# EAGLE design Task12PDS_PCBver9 (EAGLE 8.0.2)
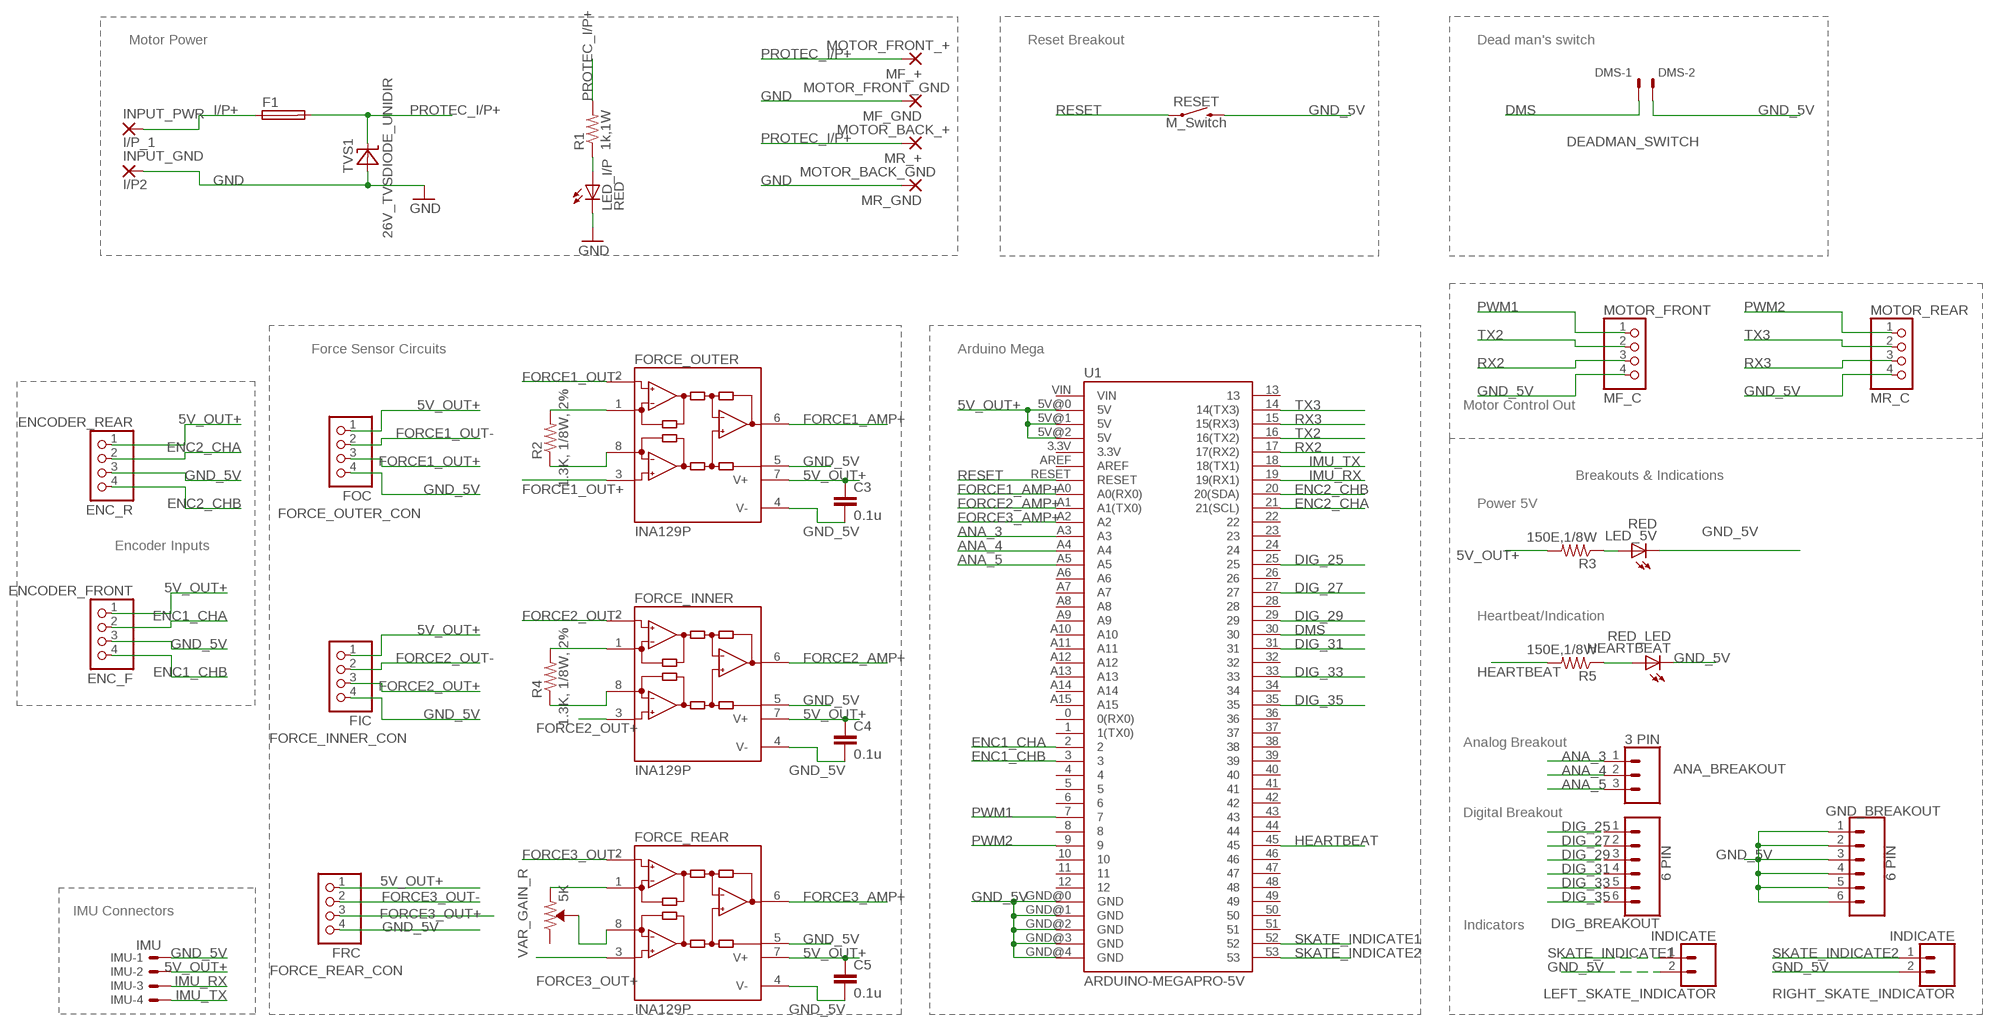
[diagram p0: schematic, sheet 1]

## Parts
ANA_BREAKOUT  3 PIN  CONN_03  [1X03]
C3  0.1u  C-EUC1206  [C1206]
C4  0.1u  C-EUC1206  [C1206]
C5  0.1u  C-EUC1206  [C1206]
DIG_BREAKOUT  6 PIN  CONN_06SILK_FEMALE_PTH  [1X06]
DMS  DEADMAN_SWITCH  22-23-2021  [22-23-2021]
ENCODER_FRONT  ENC_F  PINHD-1X4/90  [1X04/90]
ENCODER_REAR  ENC_R  PINHD-1X4/90  [1X04/90]
F1  FASTBLOW_FUSE_10A  TE5  [TE5]
FORCE_INNER  INA129P  [DIL08]
FORCE_INNER_CON  FIC  PINHD-1X4/90  [1X04/90]
FORCE_OUTER  INA129P  [DIL08]
FORCE_OUTER_CON  FOC  PINHD-1X4/90  [1X04/90]
FORCE_REAR  INA129P  [DIL08]
FORCE_REAR_CON  FRC  PINHD-1X4/90  [1X04/90]
GND_BREAKOUT  6 PIN  CONN_06SILK_FEMALE_PTH  [1X06]
HEARTBEAT  RED_LED  LEDSMT1206  [1206]
IMU  IMU  22-23-2041  [22-23-2041]
INPUT_GND  I/P2  WIREPAD3,81/1,1  [3,81/1,1]
INPUT_PWR  I/P_1  WIREPAD3,81/1,1  [3,81/1,1]
LED_5V  RED  LEDSMT1206  [1206]
LED_I/P  RED  LEDSMT1206  [1206]
LEFT_SKATE_INDICATOR  INDICATE  CONN_02  [1X02]
MF_+  MOTOR_FRONT_+  WIREPAD3,81/1,1  [3,81/1,1]
MF_GND  MOTOR_FRONT_GND  WIREPAD3,81/1,1  [3,81/1,1]
MOTOR_FRONT  MF_C  PINHD-1X4/90  [1X04/90]
MOTOR_REAR  MR_C  PINHD-1X4/90  [1X04/90]
MR_+  MOTOR_BACK_+  WIREPAD3,81/1,1  [3,81/1,1]
MR_GND  MOTOR_BACK_GND  WIREPAD3,81/1,1  [3,81/1,1]
R1  1k,1W  R-US_M1206  [M1206]
R2  1.3K, 1/8W, 2%  R-US_M1206  [M1206]
R3  150E,1/8W  R-US_M1206  [M1206]
R4  1.3K, 1/8W, 2%  R-US_M1206  [M1206]
R5  150E,1/8W  R-US_M1206  [M1206]
RESET  M_Switch  MOMENTARY-SWITCH-SPST-PTH-6.0MM  [TACTILE_SWITCH_PTH_6.0MM]
RIGHT_SKATE_INDICATOR  INDICATE  CONN_02  [1X02]
TVS1  26V_TVSDIODE_UNIDIR  [DO214AC]
U1  ARDUINO-MEGAPRO-5V  [ARDUINO_MEGA-PRO-5V]
VAR_GAIN_R  5K  TRIMPOT-PTH-10MM-KNOB-1/2W-10%  [TRIMPOT-PTH-3386U]

## Nets
5V_OUT+: C3.1 C4.1 C5.1 ENCODER_FRONT.1 ENCODER_REAR.1 FORCE_INNER.7(V+) FORCE_INNER_CON.1 FORCE_OUTER.7(V+) FORCE_OUTER_CON.1 FORCE_REAR.7(V+) FORCE_REAR_CON.1 IMU.2 R3.2 U1.5V@0(5V) U1.5V@1(5V) U1.5V@2(5V)
ANA_3: ANA_BREAKOUT.1 U1.A3
ANA_4: ANA_BREAKOUT.2 U1.A4
ANA_5: ANA_BREAKOUT.3 U1.A5
DIG_25: DIG_BREAKOUT.1 U1.25
DIG_27: DIG_BREAKOUT.2 U1.27
DIG_29: DIG_BREAKOUT.3 U1.29
DIG_31: DIG_BREAKOUT.4 U1.31
DIG_33: DIG_BREAKOUT.5 U1.33
DIG_35: DIG_BREAKOUT.6 U1.35
DMS: DMS.1 U1.30
ENC1_CHA: ENCODER_FRONT.2 U1.2
ENC1_CHB: ENCODER_FRONT.4 U1.3
ENC2_CHA: ENCODER_REAR.2 U1.21(21(SCL))
ENC2_CHB: ENCODER_REAR.4 U1.20(20(SDA))
FORCE1_AMP+: FORCE_OUTER.6(OUT) U1.A0(A0(RX0))
FORCE1_OUT+: FORCE_OUTER.3(+IN) FORCE_OUTER_CON.3
FORCE1_OUT-: FORCE_OUTER.2(-IN) FORCE_OUTER_CON.2
FORCE2_AMP+: FORCE_INNER.6(OUT) U1.A1(A1(TX0))
FORCE2_OUT+: FORCE_INNER.3(+IN) FORCE_INNER_CON.3
FORCE2_OUT-: FORCE_INNER.2(-IN) FORCE_INNER_CON.2
FORCE3_AMP+: FORCE_REAR.6(OUT) U1.A2
FORCE3_OUT+: FORCE_REAR.3(+IN) FORCE_REAR_CON.3
FORCE3_OUT-: FORCE_REAR.2(-IN) FORCE_REAR_CON.2
GND: INPUT_GND.1(P) LED_I/P.C MF_GND.1(P) MR_GND.1(P) TVS1.A
GND_5V: C3.2 C4.2 C5.2 DMS.2 ENCODER_FRONT.3 ENCODER_REAR.3 FORCE_INNER.4(V-) FORCE_INNER.5(REF) FORCE_INNER_CON.4 FORCE_OUTER.4(V-) FORCE_OUTER.5(REF) FORCE_OUTER_CON.4 FORCE_REAR.4(V-) FORCE_REAR.5(REF) FORCE_REAR_CON.4 GND_BREAKOUT.1 GND_BREAKOUT.2 GND_BREAKOUT.3 GND_BREAKOUT.4 GND_BREAKOUT.5 GND_BREAKOUT.6 HEARTBEAT.C IMU.1 LED_5V.C LEFT_SKATE_INDICATOR.2 MOTOR_FRONT.4 MOTOR_REAR.4 RESET.3 RIGHT_SKATE_INDICATOR.2 U1.GND@0(GND) U1.GND@1(GND) U1.GND@2(GND) U1.GND@3(GND) U1.GND@4(GND)
HEARTBEAT: R5.2 U1.45
I/P+: F1.1 INPUT_PWR.1(P)
IMU_RX: IMU.3 U1.19(19(RX1))
IMU_TX: IMU.4 U1.18(18(TX1))
N$1: HEARTBEAT.A R5.1
N$2: FORCE_OUTER.1(RG) R2.2
N$3: LED_I/P.A R1.1
N$4: FORCE_OUTER.8(RG) R2.1
N$5: LED_5V.A R3.1
N$6: FORCE_INNER.1(RG) R4.2
N$7: FORCE_INNER.8(RG) R4.1
N$8: FORCE_REAR.1(RG) VAR_GAIN_R.1(CCW)
N$9: FORCE_REAR.8(RG) VAR_GAIN_R.2(WIPER)
PROTEC_I/P+: F1.2 MF_+.1(P) MR_+.1(P) R1.2 TVS1.C
PWM1: MOTOR_FRONT.1 U1.7
PWM2: MOTOR_REAR.1 U1.9
RESET: RESET.1 U1.RESET
RX2: MOTOR_FRONT.3 U1.17(17(RX2))
RX3: MOTOR_REAR.3 U1.15(15(RX3))
SKATE_INDICATE1: LEFT_SKATE_INDICATOR.1 U1.52
SKATE_INDICATE2: RIGHT_SKATE_INDICATOR.1 U1.53
TX2: MOTOR_FRONT.2 U1.16(16(TX2))
TX3: MOTOR_REAR.2 U1.14(14(TX3))
Unconnected: U1.0(0(RX0)) U1.1(1(TX0)) U1.3.3V U1.4 U1.5 U1.6 U1.8 U1.10 U1.11 U1.12 U1.13 U1.22 U1.23 U1.24 U1.26 U1.28 U1.32 U1.34 U1.36 U1.37 U1.38 U1.39 U1.40 U1.41 U1.42 U1.43 U1.44 U1.46 U1.47 U1.48 U1.49 U1.50 U1.51 U1.A6 U1.A7 U1.A8 U1.A9 U1.A10 U1.A11 U1.A12 U1.A13 U1.A14 U1.A15 U1.AREF U1.VIN VAR_GAIN_R.3(CW)

## Notes on the sheet
- Motor Power | Reset Breakout | Dead man's switch
- Force Sensor Circuits | Arduino Mega
- Motor Control Out
- Breakouts & Indications
- Power 5V
- Encoder Inputs
- Heartbeat/Indication
- Analog Breakout
- Digital Breakout
- IMU Connectors
- Indicators

## Library data of the parts
ANA_BREAKOUT = SparkFun-Coils:CONN_03: Multi connection point. Often used as Generic Header-pin footprint for 0.1 inch spaced/style header connections On any of the 0.1 inch spaced packages, you can populate with these: Break Away Headers - Straight <https://www.sparkfun.com/products/116> (PRT-00116) Break Away Male Headers - Right Angle <https://www.sparkfun.com/products/553> (PRT-00553) Female Headers <https://www.sparkfun.com/products/115> (PRT-00115) Break Away Headers - Machine Pin <https://www.sparkfun.com/products/117> (PRT-00117) Break Away Female Headers - Swiss Machine Pin <https://www.sparkfun.com/products/743> (PRT-00743) Stackable Header - 3 Pin (Female, 0.1") <https://www.sparkfun.com/products/13875> (PRT-13875) For SCREWTERMINALS and SPRING TERMINALS visit here: Screw Terimnals on SparkFun.com <https://www.sparkfun.com/search/results?term=Screw+Terminals> (5mm/3.5mm/2.54mm spacing) This device is also useful as a general connection point to wire up your design to another part of your project. Our various solder wires solder well into these plated through hole pads. Hook-Up Wire - Assortment (Stranded, 22 AWG) <https://www.sparkfun.com/products/11375> (PRT-11375) Hook-Up Wire - Assortment (Solid Core, 22 AWG) <https://www.sparkfun.com/products/11367> (PRT-11367) View the entire wire category on our website here <https://www.sparkfun.com/categories/141> Special notes: Molex polarized connector foot print use with SKU : PRT-08232 with associated crimp pins and housings.
C3-C5 = rcl:C-EU: CAPACITOR, European symbol
DIG_BREAKOUT GND_BREAKOUT = SparkFun-Coils:CONN_06: Multi connection point. Often used as Generic Header-pin footprint for 0.1 inch spaced/style header connections On any of the 0.1 inch spaced packages, you can populate with these: Break Away Headers - Straight <https://www.sparkfun.com/products/116> (PRT-00116) Break Away Male Headers - Right Angle <https://www.sparkfun.com/products/553> (PRT-00553) Female Headers <https://www.sparkfun.com/products/115> (PRT-00115) Break Away Headers - Machine Pin <https://www.sparkfun.com/products/117> (PRT-00117) Break Away Female Headers - Swiss Machine Pin <https://www.sparkfun.com/products/743> (PRT-00743) Arduino Stackable Header - 6 Pin <https://www.sparkfun.com/products/9280> (PRT-09280) For SCREWTERMINALS and SPRING TERMINALS visit here: Screw Terimnals on SparkFun.com <https://www.sparkfun.com/search/results?term=Screw+Terminals> (5mm/3.5mm/2.54mm spacing) This device is also useful as a general connection point to wire up your design to another part of your project. Our various solder wires solder well into these plated through hole pads. Hook-Up Wire - Assortment (Stranded, 22 AWG) <https://www.sparkfun.com/products/11375> (PRT-11375) Hook-Up Wire - Assortment (Solid Core, 22 AWG) <https://www.sparkfun.com/products/11367> (PRT-11367) View the entire wire category on our website here <https://www.sparkfun.com/categories/141>; PROD_ID: CONN-08437
DMS = con-molex:22-23-2021: .100" (2.54mm) Center Header - 2 Pin; MF: MOLEX; MPN: 22-23-2021; OC_FARNELL: 1462926; OC_NEWARK: 25C3832
ENCODER_FRONT ENCODER_REAR FORCE_INNER_CON FORCE_OUTER_CON FORCE_REAR_CON MOTOR_FRONT MOTOR_REAR = pinhead:PINHD-1X4: PIN HEADER
F1 = fuse:TE5: FUSE Wickmann; OC_FARNELL: unknown; OC_NEWARK: unknown
FORCE_INNER FORCE_OUTER FORCE_REAR = burr-brown:INA129: Instrumentation Amplifiers Precision, Low Power; MF: TEXAS INSTRUMENTS; MPN: INA129P; OC_FARNELL: 1212414; OC_NEWARK: 74C9786
HEARTBEAT LED_5V LED_I/P = led:LED: LED OSRAM: - CHIPLED LG R971, LG N971, LY N971, LG Q971, LY Q971, LO R971, LY R971 LH N974, LH R974 LS Q976, LO Q976, LY Q976 LO Q996 - Hyper CHIPLED LW Q18S LB Q993, LB Q99A, LB R99A - SideLED LS A670, LO A670, LY A670, LG A670, LP A670 LB A673, LV A673, LT A673, LW A673 LH A674 LY A675 LS A676, LA A676, LO A676, LY A676, LW A676 LS A679, LY A679, LG A679 - Hyper Micro SIDELED® LS Y876, LA Y876, LO Y876, LY Y876 LT Y87S - SmartLED LW L88C, LW L88S LB L89C, LB L89S, LG L890 LS L89K, LO L89K, LY L89K LS L896, LA L896, LO L896, LY L896 - TOPLED LS T670, LO T670, LY T670, LG T670, LP T670 LSG T670, LSP T670, LSY T670, LOP T670, LYG T670 LG T671, LOG T671, LSG T671 LB T673, LV T673, LT T673, LW T673 LH T674 LS T676, LA T676, LO T676, LY T676, LB T676, LH T676, LSB T676, LW T676 LB T67C, LV T67C, LT T67C, LS T67K, LO T67K, LY T67K, LW E67C LS E67B, LA E67B, LO E67B, LY E67B, LB E67C, LV E67C, LT E67C LW T67C LS T679, LY T679, LG T679 LS T770, LO T770, LY T770, LG T770, LP T770 LB T773, LV T773, LT T773, LW T773 LH T774 LS E675, LA E675, LY E675, LS T675 LS T776, LA T776, LO T776, LY T776, LB T776 LHGB T686 LT T68C, LB T68C - Hyper Mini TOPLED® LB M676 - Mini TOPLED Santana® LG M470 LS M47K, LO M47K, LY M47K Source: http://www.osram.convergy.de LUXEON: - LUMILED® LXK2-PW12-R00, LXK2-PW12-S00, LXK2-PW14-U00, LXK2-PW14-V00 LXK2-PM12-R00, LXK2-PM12-S00, LXK2-PM14-U00 LXK2-PE12-Q00, LXK2-PE12-R00, LXK2-PE12-S00, LXK2-PE14-T00, LXK2-PE14-U00 LXK2-PB12-K00, LXK2-PB12-L00, LXK2-PB12-M00, LXK2-PB14-N00, LXK2-PB14-P00, LXK2-PB14-Q00 LXK2-PR12-L00, LXK2-PR12-M00, LXK2-PR14-Q00, LXK2-PR14-R00 LXK2-PD12-Q00, LXK2-PD12-R00, LXK2-PD12-S00 LXK2-PH12-R00, LXK2-PH12-S00 LXK2-PL12-P00, LXK2-PL12-Q00, LXK2-PL12-R00 Source: www.luxeon.com KINGBRIGHT: KA-3528ASYC Source: www.kingbright.com
IMU = con-molex:22-23-2041: .100" (2.54mm) Center Header - 4 Pin; MF: MOLEX; MPN: 22-23-2041; OC_FARNELL: 1462920; OC_NEWARK: 38C0355
INPUT_GND INPUT_PWR MF_+ MF_GND MR_+ MR_GND = wirepad:WIREPAD: Wire PAD connect wire on PCB
LEFT_SKATE_INDICATOR RIGHT_SKATE_INDICATOR = SparkFun-Coils:CONN_02: Multi connection point. Often used as Generic Header-pin footprint for 0.1 inch spaced/style header connections On any of the 0.1 inch spaced packages, you can populate with these: Break Away Headers - Straight <https://www.sparkfun.com/products/116> (PRT-00116) Break Away Male Headers - Right Angle <https://www.sparkfun.com/products/553> (PRT-00553) Female Headers <https://www.sparkfun.com/products/115> (PRT-00115) Break Away Headers - Machine Pin <https://www.sparkfun.com/products/117> (PRT-00117) Break Away Female Headers - Swiss Machine Pin <https://www.sparkfun.com/products/743> (PRT-00743) For SCREWTERMINALS and SPRING TERMINALS visit here: Screw Terimnals on SparkFun.com <https://www.sparkfun.com/search/results?term=Screw+Terminals> (5mm/3.5mm/2.54mm spacing) This device is also useful as a general connection point to wire up your design to another part of your project. Our various solder wires solder well into these plated through hole pads. Hook-Up Wire - Assortment (Stranded, 22 AWG) <https://www.sparkfun.com/products/11375> (PRT-11375) Hook-Up Wire - Assortment (Solid Core, 22 AWG) <https://www.sparkfun.com/products/11367> (PRT-11367) View the entire wire category on our website here <https://www.sparkfun.com/categories/141> Special notes: Molex polarized connector foot print use with: PRT-08233 with associated crimp pins and housings. 2.54_SCREWTERM for use with PRT-10571. 3.5mm Screw Terminal footprints for PRT-08084 5mm Screw Terminal footprints for use with PRT-08432
R1-R5 = rcl:R-US_: RESISTOR, American symbol
RESET = SparkFun-Sensors:MOMENTARY-SWITCH-SPST: Momentary Switch (Pushbutton) - SPST Normally-open (NO) SPST momentary switches (buttons, pushbuttons). Variants PTH-12MM - 12mm square, through-hole Momentary Pushbutton Switch - 12mm Square <https://www.sparkfun.com/products/9190> (COM-09190) PTH-6.0MM, PTH-6.0MM-KIT - 6.0mm square, through-hole Mini Pushbutton Switch <https://www.sparkfun.com/products/97> (COM-00097) KIT package intended for soldering kit's - only one side of pads' copper is exposed. PTH-RIGHT-ANGLE-KIT - Right-angle, through-hole Right Angle Tactile Button <https://www.sparkfun.com/products/10791> - Used on SparkFun BigTime Watch Kit <https://www.sparkfun.com/products/11734> SMD-12MM - 12mm square, surface-mount Tactile Button - SMD (12mm) <https://www.sparkfun.com/products/12993> (COM-12993) Used on SparkFun PicoBoard <https://www.sparkfun.com/products/11888> SMD-4.5MM - 4.5mm Square Trackball Switch Used on SparkFun Blackberry Trackballer Breakout <https://www.sparkfun.com/products/13169> SMD-4.6MMX2.8MM - 4.60mm x 2.80mm, surface mount Used on SparkFun SAMD21 Mini Breakout <https://www.sparkfun.com/products/13664> SMD-5.2MM, SMD-5.2-REDUNDANT - 5.2mm square, surface-mount Mini Pushbutton Switch - SMD <https://www.sparkfun.com/products/8720> (COM-08720) Used on Arduino Pro Mini <https://www.sparkfun.com/products/11114> REDUNDANT package connects both switch circuits together SMD-6.0X3.5MM - 6.0 x 3.5mm, surface mount Momentary Reset Switch SMD <https://www.sparkfun.com/products/8229> (COM-08229) SMD-6.2MM-TALL - 6.2mm square, surface mount Tactile Button - SMD (6mm) <https://www.sparkfun.com/products/12992> Used on SparkFun Digital Sandbox <https://www.sparkfun.com/products/12651> SMD-RIGHT-ANGLE - Right-angle, surface mount Used on SparkFun Block for Intel® Edison - Arduino <https://www.sparkfun.com/products/13036>; PROD_ID: SWCH-08441; SF_SKU: COM-00097
TVS1 = PowerDistribution:26V_TVSDIODE_UNIDIR
U1 = SparkFun-Boards:ARDUINO-MEGA: Arduino Mega board footprint
VAR_GAIN_R = SparkFun-RF:TRIMPOT: Trimming Potentiometer (Trimpot) Three-terminal potentiometers, with an adjustable wiper and two adjustable resistors. A pot can be used to create a configurable voltage divider, or as a variable resistor. "Trimpots" are a subset of potentiometers, usually intended for "set-and-forget" applications. They're often more delicate than standard potentiometers - rated for fewer turns. Variants PTH-KNOB - PTH Trimpot w/ finger-adjustable knob Trimpot 10K with Knob <https://www.sparkfun.com/products/9806> (COM-09806) Datasheet <http://www.sparkfun.com/datasheets/Components/General/TSR-3386.pdf> SMD-3MM-CLOSED-FRAME - SMD 3mm Square Closed-Frame Trimpot Used on e.g. EasyDriver - Stepper Motor Driver <https://www.sparkfun.com/products/12779> Datasheet <http://www.bitechnologies.com/pdfs/22.pdf> (22AR10KTR) SMD-5MM - SMD 5mm Square Closed-Frame Trimpot Used on e.g. IOIO-OTG - V2.2 <https://www.sparkfun.com/products/13613> Datasheet <http://www.vishay.com/docs/51008/ts53.pdf> (TS53YL502MR10) SMD-3MM-1/10W-25% - 3mm Square Open-Frame Trimpot Used on e.g. SparkFun Shapeoko <https://www.sparkfun.com/products/13899> Datasheet <http://www.bourns.com/docs/Product-Datasheets/TC33.pdf> (TC33X-2-103E); PROD_ID: RES-09730; SF_SKU: COM-09806; VALUE: 10k

## Net classes
0 default-1: width 0.61 mm
1 default-2: width 0.61 mm

## Board
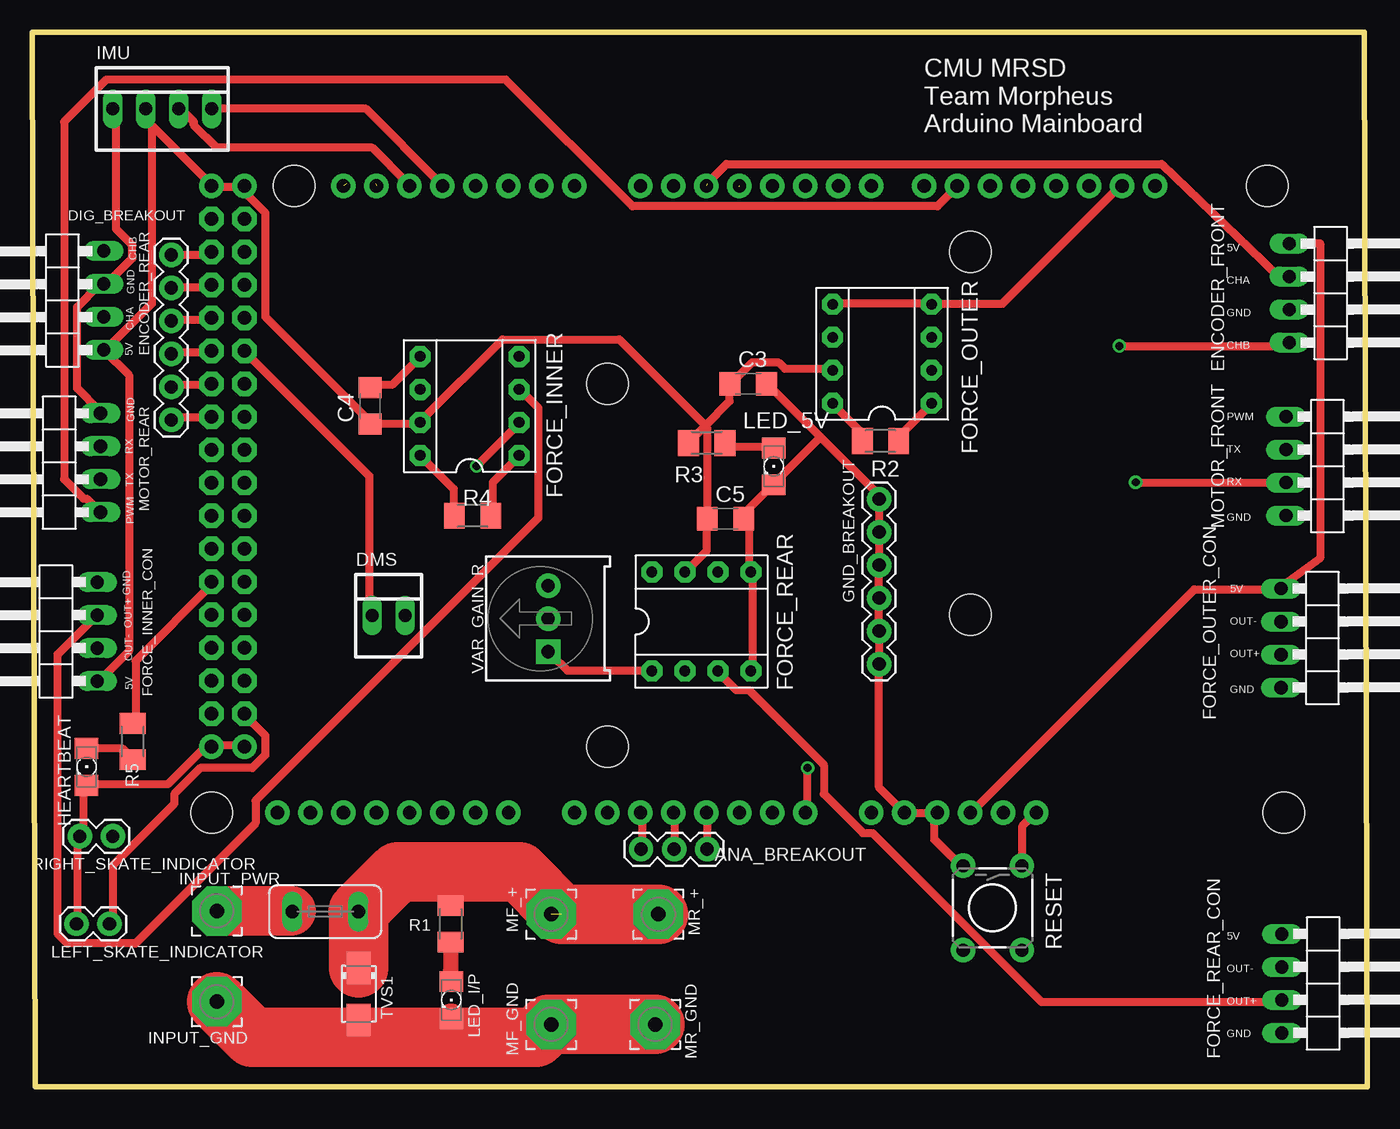
[diagram p1: board, top side]
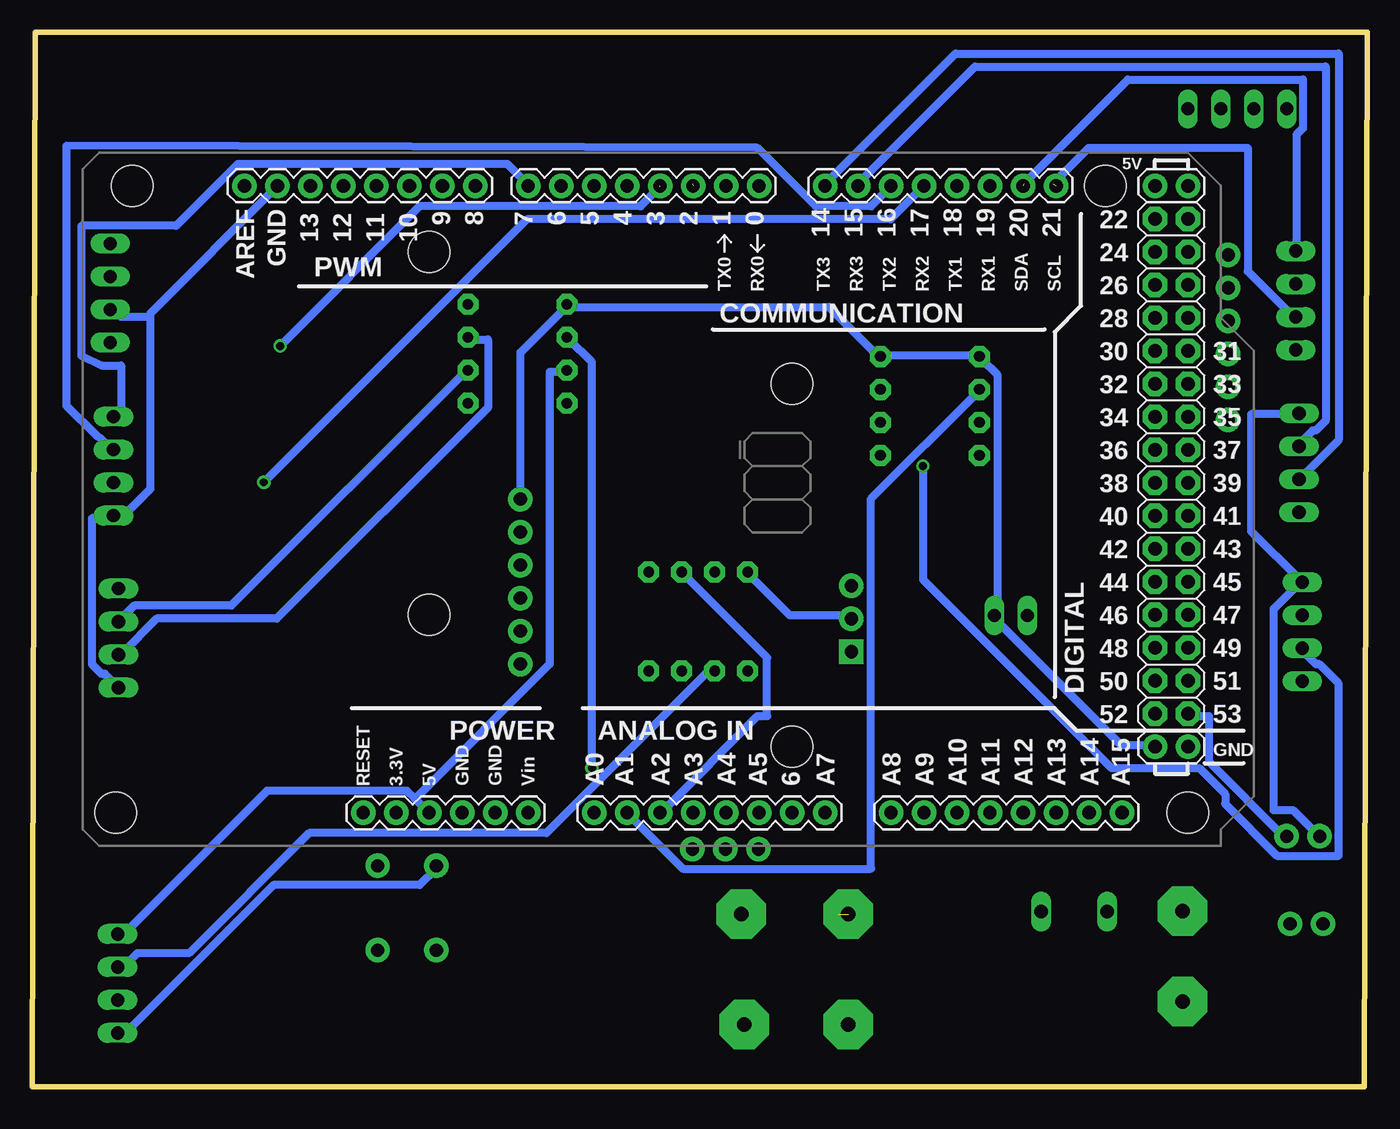
[diagram p2: board, bottom side, seen from below]

Size 102.74 x 81.16 mm. Coordinates in mm from the lower left corner, seen from the top.
Outline: 0.2,0 102.74,0 102.54,81.16 0,81.16 0.2,0
Copper layers (1*16): Top 0.035mm / dielectric 1.5mm / Bottom 0.035mm
Design rules "default": minimum track width 10mil, minimum drill 24mil, track to track 8mil, track to pad 8mil, pad to pad 8mil, via to via 8mil, smd to smd 8mil, copper to edge 40mil, drill to drill 8mil, minimum pad ring 10mil, minimum via ring 8mil, stop-mask expansion 4mil, vias tented up to drill 0mil, thermal gap 10mil

### Footprints (pad centres in the part's own frame; a part is rotated, then mirrored left to right if it is on the bottom)
1X03 = drill 1.016 pad 1.88: 1 0,0; 2 2.54,0; 3 5.08,0
C1206 = smd 1.6 x 1.8: 1 -1.4,0; 2 1.4,0
1X06 = drill 1.016 pad 1.88: 1 0,0; 2 2.54,0; 3 5.08,0; 4 7.62,0; 5 10.16,0; 6 12.7,0
22-23-2021 = drill 1 long: 1 -1.27,0; 2 1.27,0
1X04/90 = drill 1.016 long: 1 -3.81,-3.81; 2 -1.27,-3.81; 3 1.27,-3.81; 4 3.81,-3.81
TE5 = drill 1.016 long: 1 -2.54,0; 2 2.54,0
DIL08 = drill 0.813 pad 1.6 octagon: 1 -3.81,-3.81; 2 -1.27,-3.81; 3 1.27,-3.81; 4 3.81,-3.81; 5 3.81,3.81; 6 1.27,3.81; 7 -1.27,3.81; 8 -3.81,3.81
1206 = smd 1.6 x 1.803: A -1.422,0; C 1.422,0
22-23-2041 = drill 1 long: 1 -3.81,0; 2 -1.27,0; 3 1.27,0; 4 3.81,0
3,81/1,1 = drill 1.118 pad 3.81 octagon: 1 0,0
1X02 = drill 1.016 pad 1.88: 1 0,0; 2 2.54,0
M1206 = smd 1.6 x 2: 1 -1.4,0; 2 1.4,0
TACTILE_SWITCH_PTH_6.0MM = drill 1.016 pad 1.88: 1 -3.251,2.261; 2 3.251,2.261; 3 -3.251,-2.261; 4 3.251,-2.261
DO214AC = smd 2.438 x 1.829: A 2,0; C -2,0
ARDUINO_MEGA-PRO-5V = drill 1.016 pad 1.88: 0 -52.07,50.8; 1 -49.53,50.8; 2 -46.99,50.8; 3 -44.45,50.8; 3.3V -24.13,2.54; 4 -41.91,50.8; 5 -39.37,50.8; 5V@0 -26.67,2.54; 5V@1 -82.55,50.8; 5V@2 -85.09,50.8; 6 -36.83,50.8; 7 -34.29,50.8; 8 -30.226,50.8; 9 -27.686,50.8; 10 -25.146,50.8; 11 -22.606,50.8; 12 -20.066,50.8; 13 -17.526,50.8; 14 -57.15,50.8; 15 -59.69,50.8; 16 -62.23,50.8; 17 -64.77,50.8; 18 -67.31,50.8; 19 -69.85,50.8; 20 -72.39,50.8; 21 -74.93,50.8; A0 -39.37,2.54; A1 -41.91,2.54; A2 -44.45,2.54; A3 -46.99,2.54; A4 -49.53,2.54; A5 -52.07,2.54; A6 -54.61,2.54; A7 -57.15,2.54; A8 -62.23,2.54; A9 -64.77,2.54; A10 -67.31,2.54; A11 -69.85,2.54; A12 -72.39,2.54; A13 -74.93,2.54; A14 -77.47,2.54; A15 -80.01,2.54; AREF -12.446,50.8; GND@0 -29.21,2.54; GND@1 -31.75,2.54; GND@2 -82.55,7.62; GND@3 -85.09,7.62; GND@4 -14.986,50.8; RESET -21.59,2.54; VIN -34.29,2.54 | drill 1.016 pad 1.88 octagon: 22 -82.55,48.26; 23 -85.09,48.26; 24 -82.55,45.72; 25 -85.09,45.72; 26 -82.55,43.18; 27 -85.09,43.18; 28 -82.55,40.64; 29 -85.09,40.64; 30 -82.55,38.1; 31 -85.09,38.1; 32 -82.55,35.56; 33 -85.09,35.56; 34 -82.55,33.02; 35 -85.09,33.02; 36 -82.55,30.48; 37 -85.09,30.48; 38 -82.55,27.94; 39 -85.09,27.94; 40 -82.55,25.4; 41 -85.09,25.4; 42 -82.55,22.86; 43 -85.09,22.86; 44 -82.55,20.32; 45 -85.09,20.32; 46 -82.55,17.78; 47 -85.09,17.78; 48 -82.55,15.24; 49 -85.09,15.24; 50 -82.55,12.7; 51 -85.09,12.7; 52 -82.55,10.16; 53 -85.09,10.16 | hole 3.2: -3.81,50.8; -2.54,2.54; -54.61,35.56; -54.61,7.62; -78.74,50.8; -85.09,2.54; -26.67,17.78; -26.67,45.72
TRIMPOT-PTH-3386U = drill 1.016 pad 1.88 square: 1 -2.54,-0.015 | drill 1.016 pad 1.88: 2 0,-0.015; 3 2.54,-0.015

### Placement (x,y rotation side)
ANA_BREAKOUT  51.93,18.27 180 top
C3  55.1,54.12 0 top
C4  25.99,52.4 90 top
C5  53.35,43.72 0 top
DIG_BREAKOUT  10.68,64.02 270 top
DMS  27.43,36.27 0 top
DRILEGEND  [DRILEGEND]  -19.83,-29.54 0 top  (outside the outline)
ENCODER_FRONT  100.57,61.09 270 top
ENCODER_REAR  1.67,60.52 90 top
F1  22.54,13.47 0 top
FORCE_INNER  33.65,52.39 90 top
FORCE_INNER_CON  1.17,35.02 90 top
FORCE_OUTER  65.4,56.42 90 top
FORCE_OUTER_CON  99.93,34.52 270 top
FORCE_REAR  51.5,35.8 0 top
FORCE_REAR_CON  100,7.93 270 top
GND_BREAKOUT  65.18,32.52 90 top
HEARTBEAT  4.17,24.61 270 top
IMU  10,75.27 0 top
INPUT_GND  14.18,6.52 0 top
INPUT_PWR  14.18,13.52 0 top
LED_5V  57.07,47.75 270 top
LED_I/P  32.24,6.66 270 top
LEFT_SKATE_INDICATOR  5.93,12.52 180 top
MF_+  39.93,13.27 90 top
MF_GND  39.93,4.77 90 top
MOTOR_FRONT  100.32,47.77 270 top
MOTOR_REAR  1.42,48.02 90 top
MR_+  48.18,13.27 90 top
MR_GND  47.93,4.77 90 top
R1  32.18,12.52 90 top
R2  65.29,49.69 0 top
R3  51.9,49.55 180 top
R4  33.88,43.94 0 top
R5  7.7,26.56 90 top
RESET  73.91,13.75 270 top
RIGHT_SKATE_INDICATOR  6.18,19.27 180 top
TVS1  25.1,7.13 270 top
U1  98.87,18.54 0 top
VAR_GAIN_R  39.68,36.02 90 top

### Tracks (layer width: path | path; a pad name or v marks a point on that pad's centre or on a via)
5V_OUT+
  Top 0.61: U1.5V@0 72.43,21.27 89.43,38.27 95.93,38.27 FORCE_OUTER_CON.1 96.18,38.52 99.13,40.68 99.13,64.9 99.1,64.93 96.79,64.93 ENCODER_FRONT.1 | FORCE_REAR.7 50.43,39.77 51.93,41.27 51.93,43.52 C5.1 51.93,44.02 51.93,50.77 51.8,50.9 | 51.8,50.9 50.68,49.77 R3.2 | 51.8,50.9 53.68,52.77 53.68,54.02 C3.1 53.93,54.27 55.43,55.77 57.43,55.77 57.93,55.27 61.43,55.27 FORCE_OUTER.7 | FORCE_INNER_CON.1 5.18,31.27 7.43,33.52 7.43,54.77 ENCODER_REAR.1 5.68,56.77 9.18,60.27 9.18,73.77 9.3,73.9 | 9.3,73.9 13.68,69.52 U1.5V@2 13.93,69.27 16.18,69.27 U1.5V@1 16.18,69.02 17.93,67.27 17.93,59.27 25.93,51.27 C4.1 26.18,51.02 29.68,51.02 FORCE_INNER.7 29.93,51.27 36.18,57.52 45.18,57.52 51.8,50.9 | 9.3,73.9 8.93,74.27 8.93,75.27 IMU.2
  Bottom 0.61: 73.3,22.15 72.43,21.27 U1.5V@0 | 73.3,22.15 73.93,22.77 84.68,22.77 95.68,11.77 FORCE_REAR_CON.1 | 73.3,22.15 62.93,32.52 62.93,55.02 61.68,55.02 FORCE_OUTER.7
ANA_3
  Top 0.61: ANA_BREAKOUT.1 51.93,18.52 51.93,21.02 U1.A3
ANA_4
  Top 0.61: ANA_BREAKOUT.2 49.43,18.52 49.43,21.02 U1.A4
ANA_5
  Top 0.61: ANA_BREAKOUT.3 46.93,18.52 46.93,21.02 U1.A5
DIG_25
  Top 0.61: DIG_BREAKOUT.1 10.93,64.02 13.68,64.02 U1.25
DIG_27
  Top 0.61: DIG_BREAKOUT.2 10.93,61.52 13.68,61.52 U1.27
DIG_29
  Top 0.61: DIG_BREAKOUT.3 10.93,59.02 13.68,59.02 U1.29
DIG_31
  Top 0.61: DIG_BREAKOUT.4 10.93,56.52 13.68,56.52 U1.31
DIG_33
  Top 0.61: DIG_BREAKOUT.5 10.93,54.02 13.68,54.02 U1.33
DIG_35
  Top 0.61: DIG_BREAKOUT.6 10.93,51.52 13.68,51.52 U1.35
DMS
  Top 0.61: DMS.1 25.93,36.27 25.93,47.02 16.43,56.52 U1.30
ENC1_CHA  (1 unrouted)
  Top 0.61: 51.93,69.52 53.43,71.02 86.93,71.02 94.68,63.59 95.9,62.36 ENCODER_FRONT.2
ENC1_CHB  (via drill 0.61)  (1 unrouted)
  Top 0.61: v83.68,57.02 95.93,57.02 ENCODER_FRONT.4
  Bottom 0.61: v83.68,57.02 72.93,67.77 55.93,67.77 54.43,69.27
ENC2_CHA  (1 unrouted)
  Bottom 0.61: 24.18,69.52 21.43,72.27 9.18,72.27 9.18,62.77 5.68,59.27 ENCODER_REAR.2
ENC2_CHB  (1 unrouted)
  Bottom 0.61: 26.43,69.52 18.43,77.52 4.93,77.52 4.93,73.77 5.43,73.27 5.43,64.52 ENCODER_REAR.4
FORCE1_AMP+  (via drill 0.61)
  Top 0.61: v59.68,24.52 59.68,21.27 U1.A0
  Bottom 0.61: v59.68,24.52 59.68,55.77 61.43,57.52 FORCE_OUTER.6
FORCE1_OUT+
  Bottom 0.61: FORCE_OUTER_CON.3 95.93,33.27 93.18,36.02 83.93,36.02 67.68,52.27 67.68,57.52 69.18,57.52 FORCE_OUTER.3
FORCE1_OUT-
  Bottom 0.61: FORCE_OUTER_CON.2 95.93,36.02 94.93,37.02 87.43,37.02 69.43,55.02 FORCE_OUTER.2
FORCE2_AMP+
  Bottom 0.61: FORCE_INNER.6 29.93,53.52 38.18,45.27 38.18,16.77 52.68,16.77 56.93,21.02 U1.A1
FORCE2_OUT+
  Top 0.61: FORCE_INNER_CON.3 4.93,36.27 1.93,33.27 1.93,11.77 2.68,11.02 7.93,11.02 17.18,20.27 17.18,22.02 38.93,43.77 38.93,52.27 37.68,53.52 FORCE_INNER.3
FORCE2_OUT-  (via drill 0.61)
  Top 0.61: v34.18,47.77 37.43,51.02 FORCE_INNER.2
  Bottom 0.61: v34.18,47.77 34.18,39.02 19.68,24.52 12.93,24.52 10.93,22.52 10.93,21.77 6.93,17.77 2.18,17.77 2.18,31.02 3.68,32.52 3.93,32.52 4.93,33.52 FORCE_INNER_CON.2
FORCE3_AMP+
  Bottom 0.61: FORCE_REAR.6 46.18,33.02 46.18,28.52 46.93,28.52 54.18,21.27 U1.A2
FORCE3_OUT+
  Top 0.61: FORCE_REAR_CON.3 95.68,6.52 77.68,6.52 64.68,19.52 63.93,19.52 60.93,22.52 60.93,24.77 55.18,30.52 54.18,30.52 52.93,31.77 FORCE_REAR.3
FORCE3_OUT-
  Bottom 0.61: FORCE_REAR_CON.2 95.68,9.27 94.68,10.27 90.68,10.27 81.43,19.52 63.18,19.52 50.93,31.77 50.43,31.77 FORCE_REAR.2
GND
  Top 2.286: TVS1.A 25.1,3.81 | LED_I/P.C 32.43,5.06 32.43,3.81
  Top 4.572: INPUT_GND.1 16.9,3.81 25.1,3.81 32.43,3.81 38.78,3.81 39.74,4.77 MF_GND.1 MR_GND.1
GND_5V
  Top 0.61: IMU.1 6.43,75.27 6.43,66.02 7.68,64.77 7.68,63.77 5.68,61.77 ENCODER_REAR.3 5.18,61.77 3.43,60.02 3.43,53.77 5.18,52.02 MOTOR_REAR.4 | C4.2 26.18,54.02 27.68,54.02 29.68,56.02 FORCE_INNER.5 | LEFT_SKATE_INDICATOR.2 3.43,12.77 3.43,19.02 RIGHT_SKATE_INDICATOR.2 3.68,19.27 3.93,19.52 3.93,23.02 HEARTBEAT.C 4.43,23.27 10.43,23.27 13.18,26.02 13.68,26.02 U1.GND@3 13.93,26.27 16.18,26.27 U1.GND@2 | FORCE_OUTER.5 61.68,60.27 69.18,60.27 FORCE_OUTER.4 69.43,60.27 74.68,60.27 83.68,69.27 U1.GND@4 | FORCE_REAR.4 55.43,32.02 55.43,39.52 FORCE_REAR.5 55.18,39.77 55.18,43.77 C5.2 54.93,43.77 54.93,44.27 56.93,46.27 LED_5V.C 57.18,46.52 60.68,50.02 | 60.68,50.02 65.43,45.27 GND_BREAKOUT.6 65.18,45.02 65.18,42.77 GND_BREAKOUT.5 65.18,42.52 65.18,40.27 GND_BREAKOUT.4 65.18,40.02 65.18,37.77 GND_BREAKOUT.3 65.18,37.52 65.18,35.27 GND_BREAKOUT.2 65.18,35.02 65.18,32.77 GND_BREAKOUT.1 65.18,32.27 65.18,23.02 66.93,21.27 U1.GND@1 67.18,21.02 69.43,21.02 U1.GND@0 69.43,20.77 69.43,19.02 71.43,17.02 RESET.3 | 60.68,50.02 56.68,54.02 C3.2
  Bottom 0.61: MOTOR_REAR.4 5.43,51.77 8.93,51.77 8.93,42.77 5.18,39.02 FORCE_INNER_CON.4 5.18,38.77 7.18,36.77 7.18,21.27 5.68,21.27 3.68,19.27 RIGHT_SKATE_INDICATOR.2 | U1.GND@2 16.43,26.27 18.93,26.27 28.68,36.02 DMS.2 28.68,36.52 28.43,36.52 28.43,54.77 29.68,56.02 FORCE_INNER.5 29.93,56.27 37.43,56.27 FORCE_INNER.4 37.68,56.27 41.43,60.02 61.43,60.02 FORCE_OUTER.5 61.68,60.02 65.18,56.52 65.18,45.27 GND_BREAKOUT.6 | 93.68,59.27 93.68,46.02 95.68,44.02 MOTOR_FRONT.4 95.93,43.77 98.18,43.77 98.18,32.52 97.43,31.77 97.18,31.77 FORCE_OUTER_CON.4 | 93.68,59.27 95.93,59.27 ENCODER_FRONT.3 | U1.GND@4 83.93,69.27 93.68,59.52 93.68,59.27 | FORCE_REAR_CON.4 95.68,4.02 84.18,15.52 72.93,15.52 71.68,16.77 RESET.3
HEARTBEAT
  Top 0.61: R5.2 7.93,28.02 7.93,32.77 13.93,38.77 U1.45
I/P+
  Top 0.61: 19.93,13.52 F1.1 | 14.43,13.52 INPUT_PWR.1
  Top 3.81: 14.43,13.52 19.93,13.52
IMU_RX
  Top 0.61: IMU.3 11.43,75.27 12.43,74.27 12.43,74.02 14.18,72.27 26.18,72.27 28.93,69.52 U1.19
IMU_TX
  Top 0.61: IMU.4 13.93,75.27 25.68,75.27 31.43,69.52 U1.18
N$1
  Top 0.61: HEARTBEAT.A 4.18,26.02 6.93,26.02 7.68,25.27 R5.1
N$2
  Top 0.61: R2.2 66.93,49.77 66.93,50.27 69.18,52.52 FORCE_OUTER.1
N$3
  Top 0.61: LED_I/P.A 32.18,8.27 32.18,8.89 32.18,11.02 R1.1
  Top 1.143: R1.1 32.18,8.89
N$4
  Top 0.61: R2.1 63.68,49.77 63.68,50.52 61.68,52.52 FORCE_OUTER.8
N$5
  Top 0.61: LED_5V.A 56.93,49.27 53.68,49.27 53.43,49.52 R3.1
N$6
  Top 0.61: R4.2 35.43,44.02 35.43,46.52 37.43,48.52 FORCE_INNER.1
N$7
  Top 0.61: R4.1 32.43,44.02 32.43,46.02 29.93,48.52 FORCE_INNER.8
N$8
  Top 0.61: FORCE_REAR.1 47.68,32.02 41.18,32.02 39.93,33.27 VAR_GAIN_R.1
N$9
  Bottom 0.61: FORCE_REAR.8 47.68,39.52 44.43,36.27 39.93,36.27 VAR_GAIN_R.2
PROTEC_I/P+  (1 unrouted)
  Top 1.143: R1.2 32.43,14.17 32.43,16.51
  Top 4.572: MR_+.1 40.75,13.27 37.51,16.51 32.43,16.51 28.12,16.51 F1.2 25.1,13.45 TVS1.C
PWM1
  Bottom 0.61: MOTOR_FRONT.1 95.93,51.77 95.93,55.52 97.43,55.52 98.97,56.27 98.97,66.27 91.68,66.27 86.93,71.02 66.18,71.02 64.68,69.52 U1.7
PWM2
  Top 0.61: MOTOR_REAR.1 4.18,45.27 3.93,45.27 2.43,46.77 2.43,74.27 5.68,77.52 36.43,77.52 46.18,67.77 69.68,67.77 71.18,69.27 U1.9
RESET
  Top 0.61: RESET.1 76.18,17.02 76.18,20.02 77.18,21.02 U1.RESET
RX2  (via drill 0.61)
  Top 0.61: v84.93,46.52 95.68,46.52 MOTOR_FRONT.3
  Bottom 0.61: v84.93,46.52 64.68,66.77 36.68,66.77 34.18,69.27 U1.17
RX3
  Bottom 0.61: MOTOR_REAR.3 5.18,49.52 4.18,50.52 3.93,50.52 3.18,51.27 3.18,78.52 30.18,78.52 39.18,69.52 U1.15
SKATE_INDICATE1
  Top 0.61: LEFT_SKATE_INDICATOR.1 6.18,12.77 6.18,17.02 10.93,21.77 10.93,22.52 12.93,24.52 16.93,24.52 17.93,25.52 17.93,27.02 16.43,28.52 U1.52
SKATE_INDICATE2
  Bottom 0.61: RIGHT_SKATE_INDICATOR.1 6.43,19.27 12.18,25.02 12.18,28.52 13.68,28.52 U1.53
TX2
  Bottom 0.61: MOTOR_FRONT.2 96.56,48.95 97.56,49.95 97.81,50.11 100.13,52.43 100.13,72.43 46.93,72.27 42.43,67.77 38.18,67.77 36.68,69.27 U1.16
TX3
  Bottom 0.61: MOTOR_REAR.2 5.18,46.77 2.18,49.77 2.18,79.52 31.68,79.52 41.68,69.52 U1.14

### Text on the board
tNames: CMU MRSD / Team Morpheus / Arduino Mainboard | CHB | 5V | CHA | GND | GND | CHA | CHB | 5V | GND | PWM | RX | TX | TX | RX | GND | PWM | GND | 5V | OUT- | OUT+ | OUT- | OUT+ | 5V | GND | 5V | OUT- | OUT+ | GND
DrillLegend: LAYER-STACK
DrillLegend_01-16: 01-16 | 01-16
DrillLegend_01-20: 01-20 | 01-20